# EAGLE schematic SLIM-ADC-16 (EAGLE 6.3)
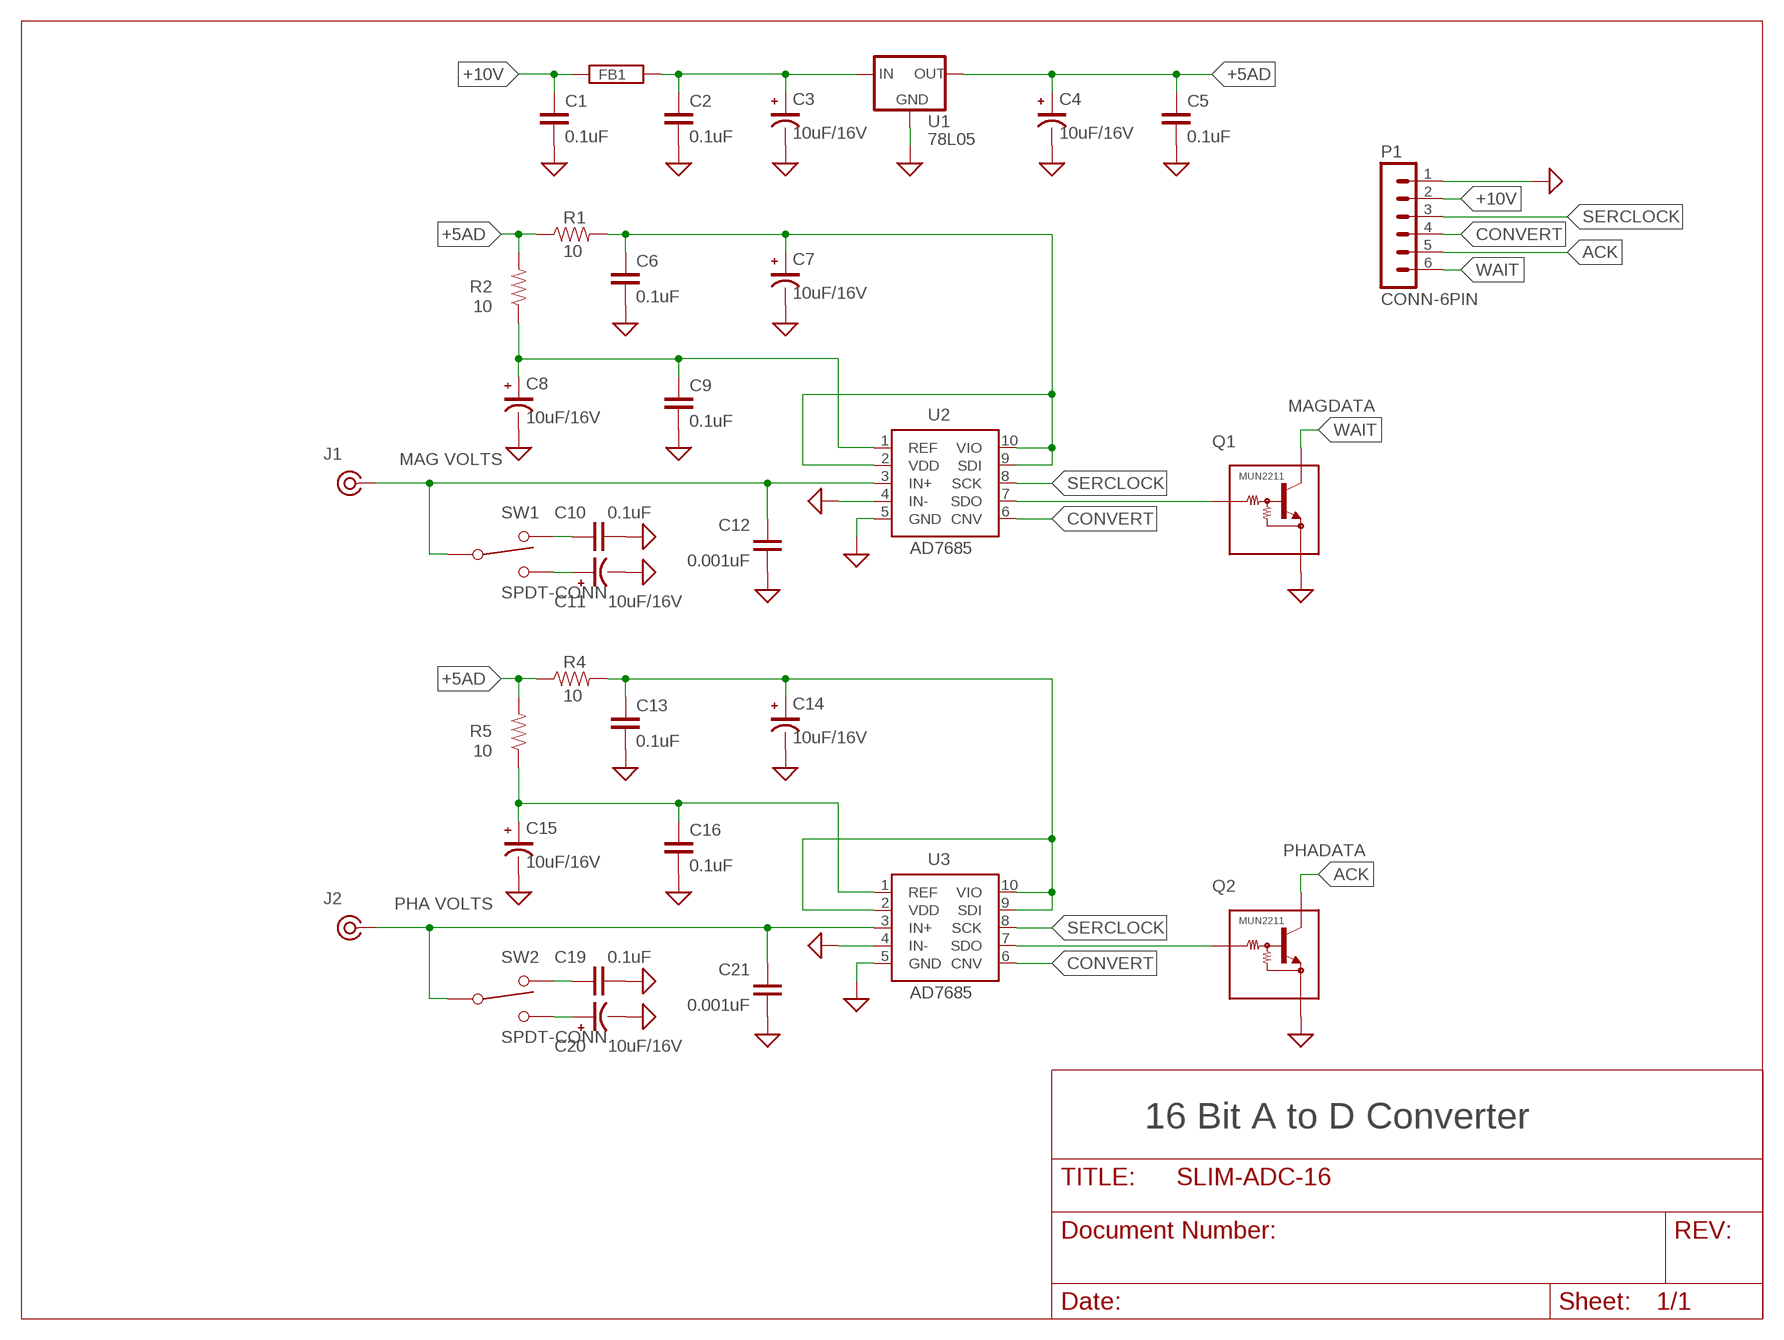
[diagram p0: schematic, sheet 1]

## Parts
C1  0.1uF  CAP0805  [0805]
C2  0.1uF  CAP0805  [0805]
C3  10uF/16V  CAP-POL1206  [EIA3216]
C4  10uF/16V  CAP-POL1206  [EIA3216]
C5  0.1uF  CAP0805  [0805]
C6  0.1uF  CAP0805  [0805]
C7  10uF/16V  CAP-POL1206  [EIA3216]
C8  10uF/16V  CAP-POL1206  [EIA3216]
C9  0.1uF  CAP0805  [0805]
C10  0.1uF  CAP0805  [0805]
C11  10uF/16V  CAP-POL1206  [EIA3216]
C12  0.001uF  CAP0805  [0805]
C13  0.1uF  CAP0805  [0805]
C14  10uF/16V  CAP-POL1206  [EIA3216]
C15  10uF/16V  CAP-POL1206  [EIA3216]
C16  0.1uF  CAP0805  [0805]
C19  0.1uF  CAP0805  [0805]
C20  10uF/16V  CAP-POL1206  [EIA3216]
C21  0.001uF  CAP0805  [0805]
FB1  FERRITE0805  [0805]
J1  COAX  [SLIM_COAX_PAD]
J2  COAX  [SLIM_COAX_PAD]
P1  CONN-6PIN  [CONN-6PIN]
Q1  MUN2211  [SOT23]
Q2  MUN2211  [SOT23]
R1  10  RESISTOR0805  [0805]
R2  10  RESISTOR0805  [0805]
R4  10  RESISTOR0805  [0805]
R5  10  RESISTOR0805  [0805]
SW1  SPDT-CONN  [CONN-3PIN]
SW2  SPDT-CONN  [CONN-3PIN]
U1  78L05  78MXXLSOT-89  [SOT89]
U2  AD7685  [MSOP10]
U3  AD7685  [MSOP10]

## Nets
+5AD: C4.A(+) C5.1 R1.1 R2.2 R4.1 R5.2 U1.1(OUT)
+10V: C1.1 FB1.1 P1.2
ACK: P1.5 Q2.C
CONVERT: P1.4 U2.6(CNV) U3.6(CNV)
GND: C1.2 C2.2 C3.C(-) C4.C(-) C5.2 C6.2 C7.C(-) C8.C(-) C9.2 C10.2 C11.C(-) C12.2 C13.2 C14.C(-) C15.C(-) C16.2 C19.2 C20.C(-) C21.2 P1.1 Q1.E Q2.E U1.2(GND) U1.4(GND) U2.4(IN-) U2.5(GND) U3.4(IN-) U3.5(GND)
N$1: C8.A(+) C9.1 R2.1 U2.1(REF)
N$2: C6.1 C7.A(+) R1.2 U2.2(VDD) U2.9(SDI) U2.10(VIO)
N$3: C12.1 J1.P$1 SW1.2 U2.3(IN+)
N$4: C10.1 SW1.1
N$5: C11.A(+) SW1.3
N$6: Q1.B U2.7(SDO)
N$7: C2.1 C3.A(+) FB1.2 U1.3(IN)
N$8: C15.A(+) C16.1 R5.1 U3.1(REF)
N$9: C13.1 C14.A(+) R4.2 U3.2(VDD) U3.9(SDI) U3.10(VIO)
N$10: C21.1 J2.P$1 SW2.2 U3.3(IN+)
N$11: C19.1 SW2.1
N$12: C20.A(+) SW2.3
N$13: Q2.B U3.7(SDO)
SERCLOCK: P1.3 U2.8(SCK) U3.8(SCK)
WAIT: P1.6 Q1.C

## Notes on the sheet
- MAGDATA
- MAG VOLTS
- PHADATA
- PHA VOLTS
- 16 Bit A to D Converter

## Power pins joined to a net without a drawn wire
GND: J1.P$2 J2.P$2

## Library data of the parts
C1 C2 C5 C6 C9 C10 C12 C13 C16 C19 C21 = SLIM:CAP: Capacitor Standard 0603 ceramic capacitor, and 0.1" leaded capacitor.
C3 C4 C7 C8 C11 C14 C15 C20 = SLIM:CAP-POL
FB1 = SLIM:FERRITE
J1 J2 = SLIM:COAX
P1 = SLIM:CONN-6PIN: PIN HEADER; OC_FARNELL: unknown; OC_NEWARK: unknown
Q1 Q2 = SLIM:MUN2211*: NPN Bias Resistor Transistor
R1 R2 R4 R5 = SLIM:RESISTOR: Resistor Basic schematic elements and footprints for 0603, 1206, and PTH resistors.
SW1 SW2 = SLIM:SPDT
U1 = SLIM:78MXXL: VOLTAGE REGULATOR
U2 U3 = SLIM:AD7685